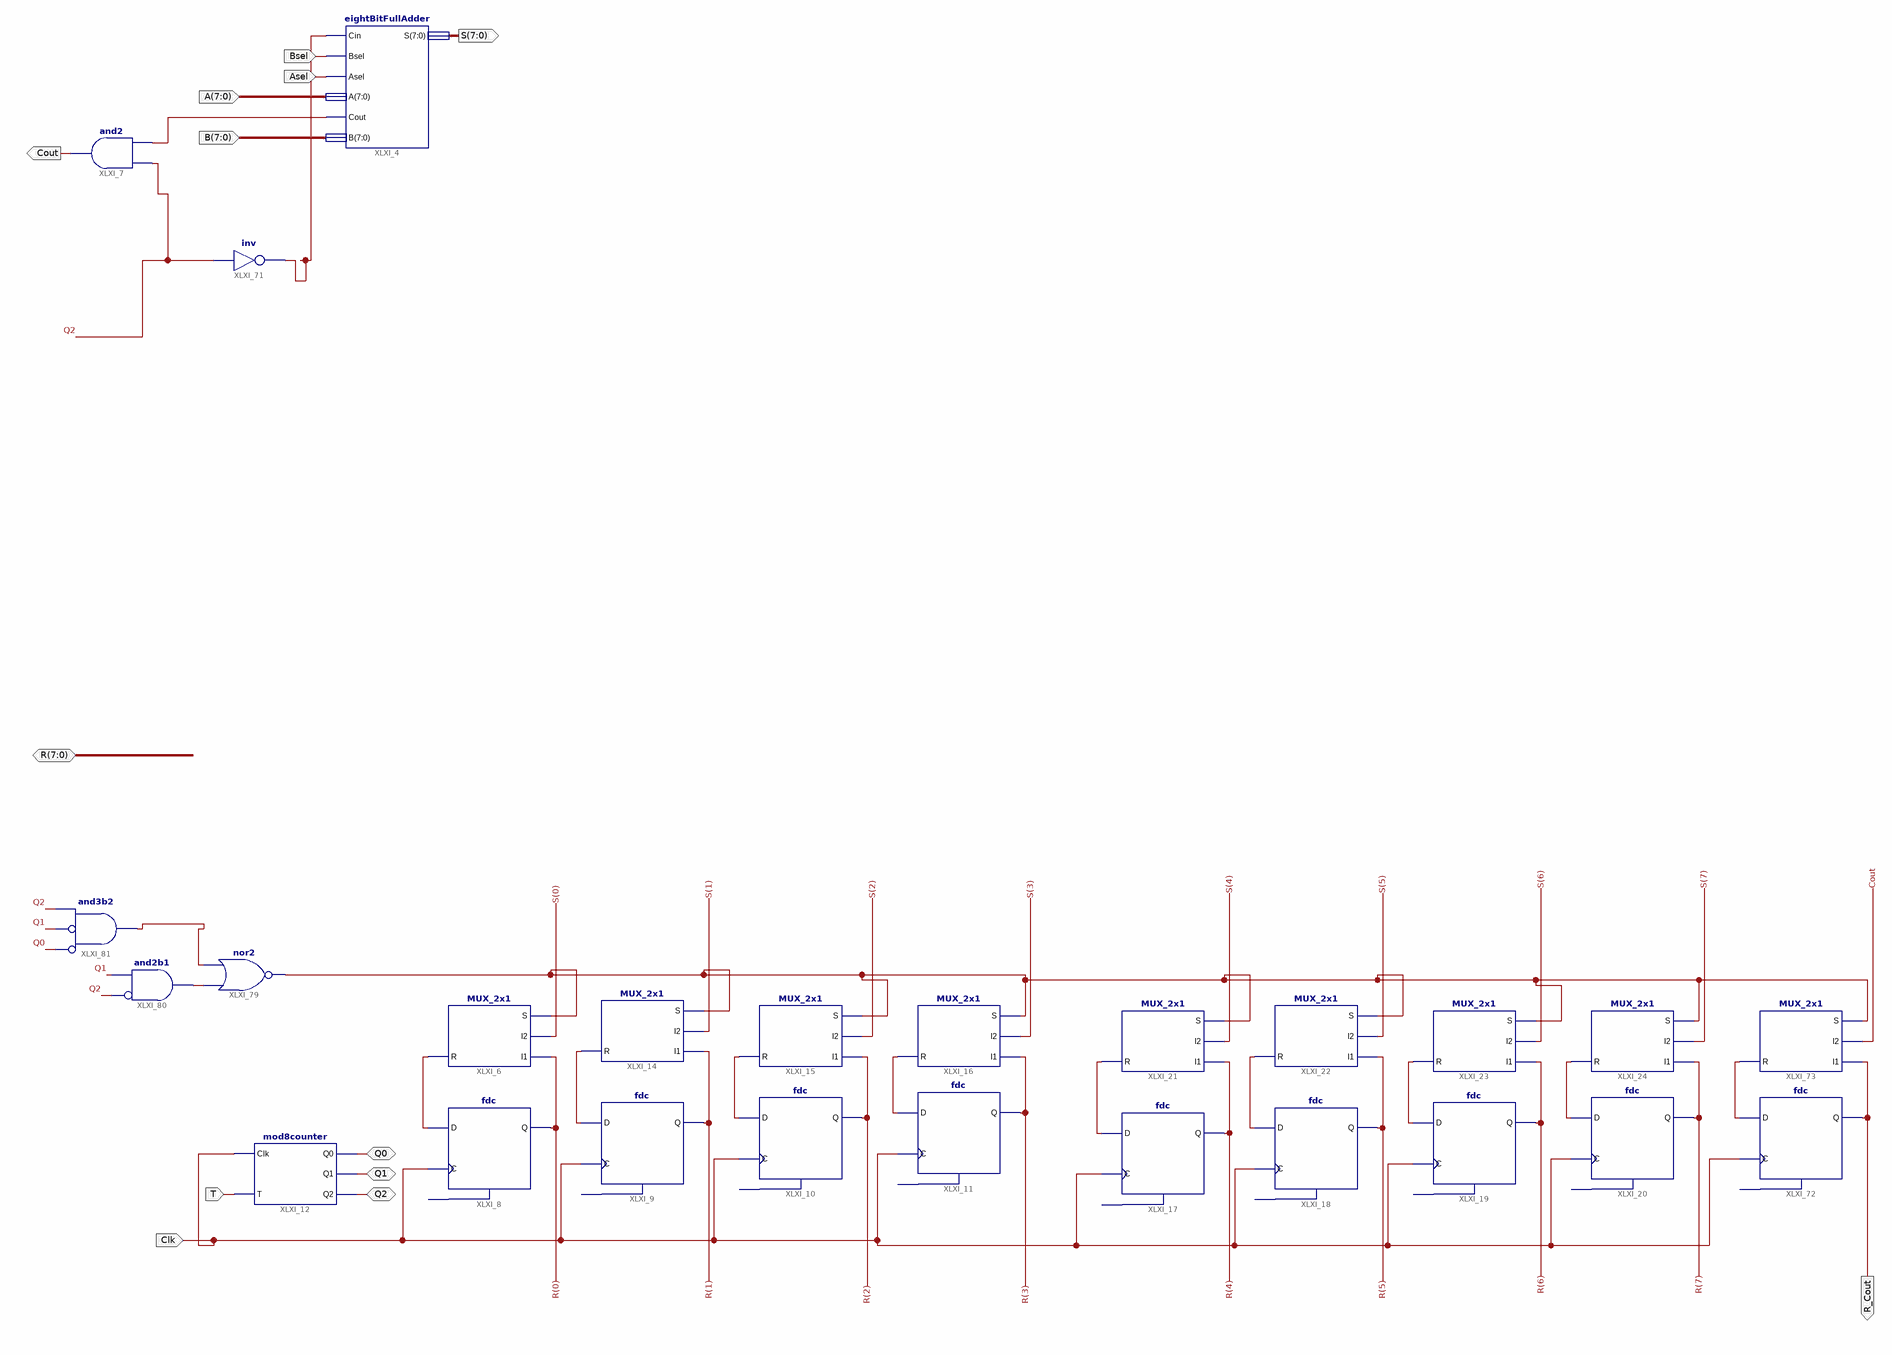
[diagram p0: schematic sheet 1]
// Xilinx ISE schematic first_a_revised.sch (spartan3) as structural Verilog: 25 symbols, 13 ports
module first_a_revised (
  input  [7:0] A,
  input  [7:0] B,
  input  Bsel,
  input  Asel,
  input  T,
  input  Clk,
  inout  Q0,
  inout  Q2,
  inout  Q1,
  inout  [7:0] R,
  output [7:0] S,
  output Cout,
  output R_Cout
);

  wire XLXN_7, XLXN_8, XLXN_9, XLXN_10, XLXN_13, XLXN_15, XLXN_29, XLXN_37, XLXN_38, XLXN_39, XLXN_40,
       XLXN_118, XLXN_133, XLXN_135;

  eightBitFullAdder XLXI_4 (.Cin(XLXN_8), .Bsel(Bsel), .Asel(Asel), .A(A), .B(B), .Cout(XLXN_13), .S(S));
  and XLXI_7 (Cout, XLXN_13, Q2);
  fdc XLXI_8 (.C(Clk), .D(XLXN_7), .Q(R[0]));  // open: CLR
  fdc XLXI_9 (.C(Clk), .D(XLXN_29), .Q(R[1]));  // open: CLR
  fdc XLXI_10 (.C(Clk), .D(XLXN_9), .Q(R[2]));  // open: CLR
  fdc XLXI_11 (.C(Clk), .D(XLXN_10), .Q(R[3]));  // open: CLR
  mod8counter XLXI_12 (.Clk(Clk), .T(T), .Q0(Q0), .Q1(Q1), .Q2(Q2));
  MUX_2x1 XLXI_6 (.I1(R[0]), .I2(S[0]), .S(XLXN_15), .R(XLXN_7));
  MUX_2x1 XLXI_14 (.I1(R[1]), .I2(S[1]), .S(XLXN_15), .R(XLXN_29));
  MUX_2x1 XLXI_15 (.I1(R[2]), .I2(S[2]), .S(XLXN_15), .R(XLXN_9));
  MUX_2x1 XLXI_16 (.I1(R[3]), .I2(S[3]), .S(XLXN_15), .R(XLXN_10));
  fdc XLXI_17 (.C(Clk), .D(XLXN_37), .Q(R[4]));  // open: CLR
  fdc XLXI_18 (.C(Clk), .D(XLXN_38), .Q(R[5]));  // open: CLR
  fdc XLXI_19 (.C(Clk), .D(XLXN_39), .Q(R[6]));  // open: CLR
  fdc XLXI_20 (.C(Clk), .D(XLXN_40), .Q(R[7]));  // open: CLR
  MUX_2x1 XLXI_21 (.I1(R[4]), .I2(S[4]), .S(XLXN_15), .R(XLXN_37));
  MUX_2x1 XLXI_22 (.I1(R[5]), .I2(S[5]), .S(XLXN_15), .R(XLXN_38));
  MUX_2x1 XLXI_23 (.I1(R[6]), .I2(S[6]), .S(XLXN_15), .R(XLXN_39));
  MUX_2x1 XLXI_24 (.I1(R[7]), .I2(S[7]), .S(XLXN_15), .R(XLXN_40));
  not XLXI_71 (XLXN_8, Q2);
  fdc XLXI_72 (.C(Clk), .D(XLXN_118), .Q(R_Cout));  // open: CLR
  MUX_2x1 XLXI_73 (.I1(R_Cout), .I2(Cout), .S(XLXN_15), .R(XLXN_118));
  nor XLXI_79 (XLXN_15, XLXN_133, XLXN_135);
  and XLXI_80 (XLXN_133, ~Q2, Q1);  // and2b1
  and XLXI_81 (XLXN_135, ~Q0, ~Q1, Q2);  // and3b2
endmodule
